# EAGLE schematic Shield Schematic (EAGLE 9.6.2)
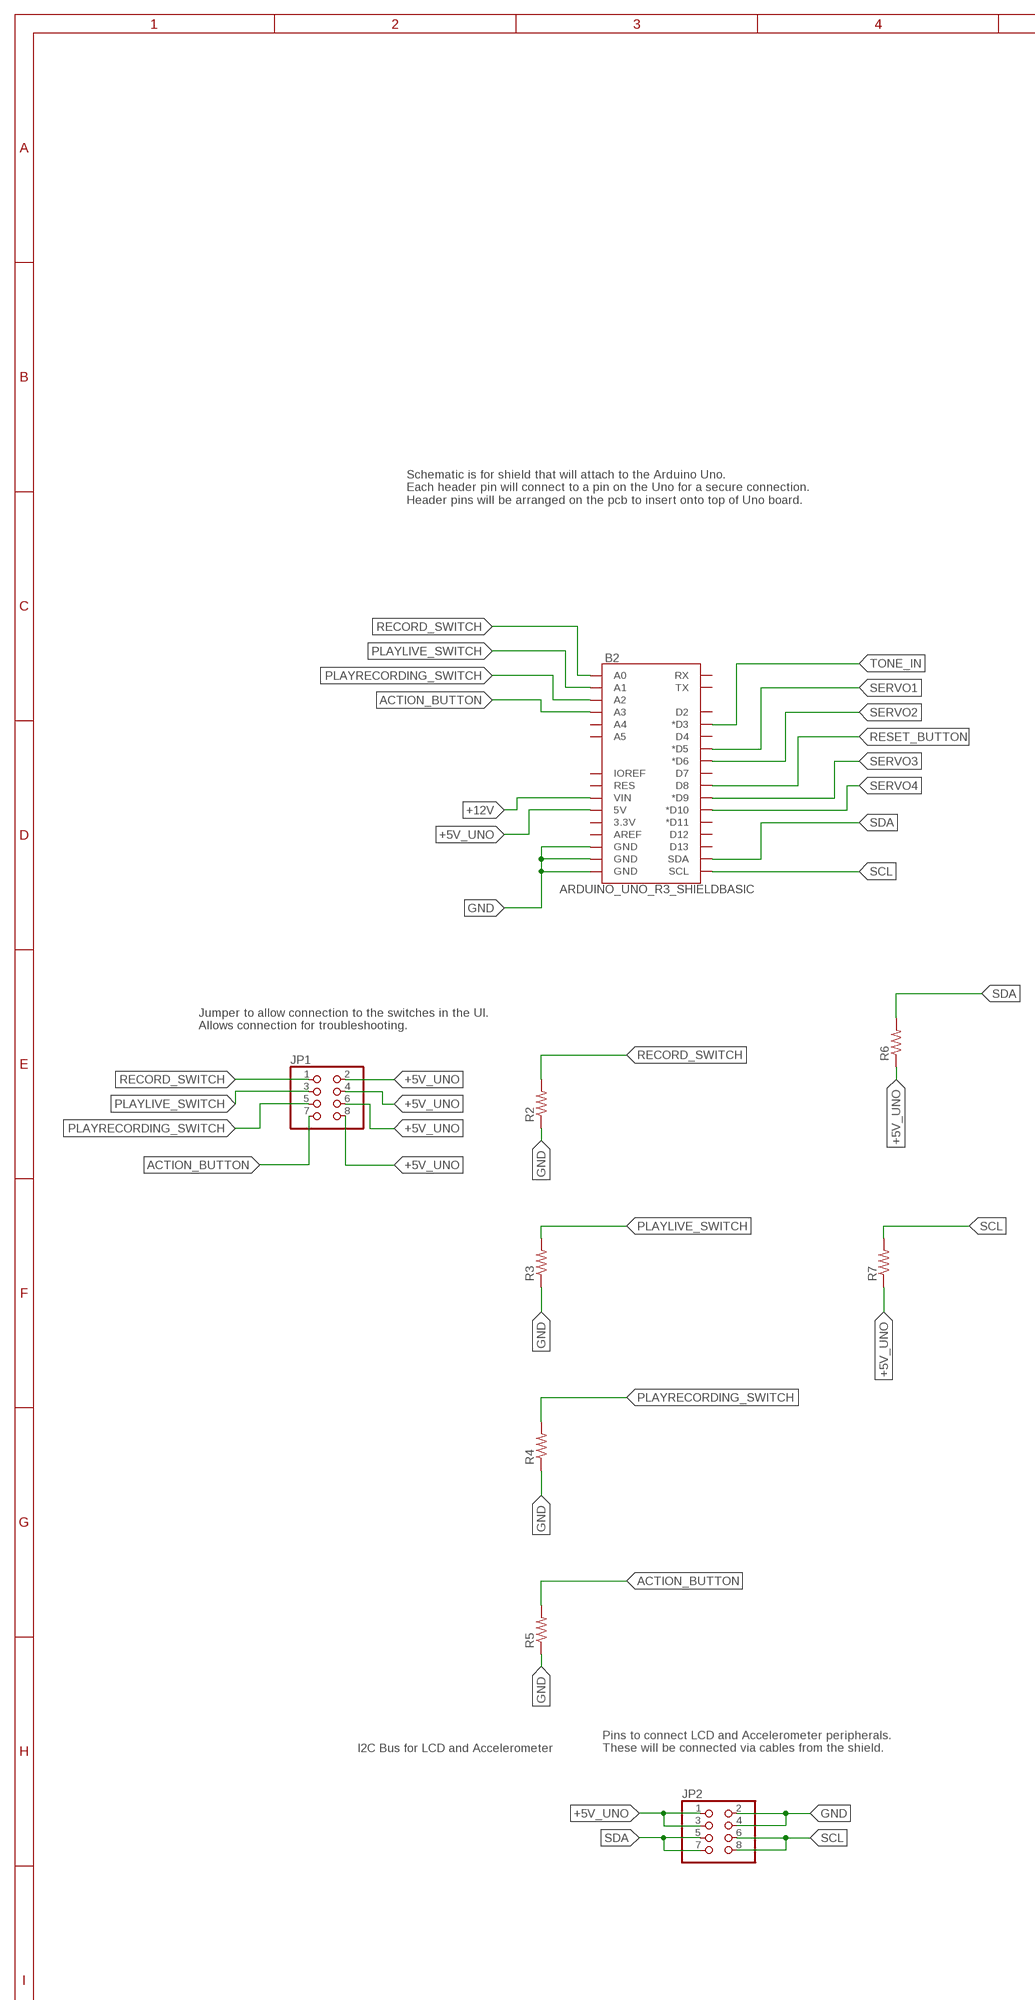
[diagram p0: schematic, sheet 1, part 1 of 2]
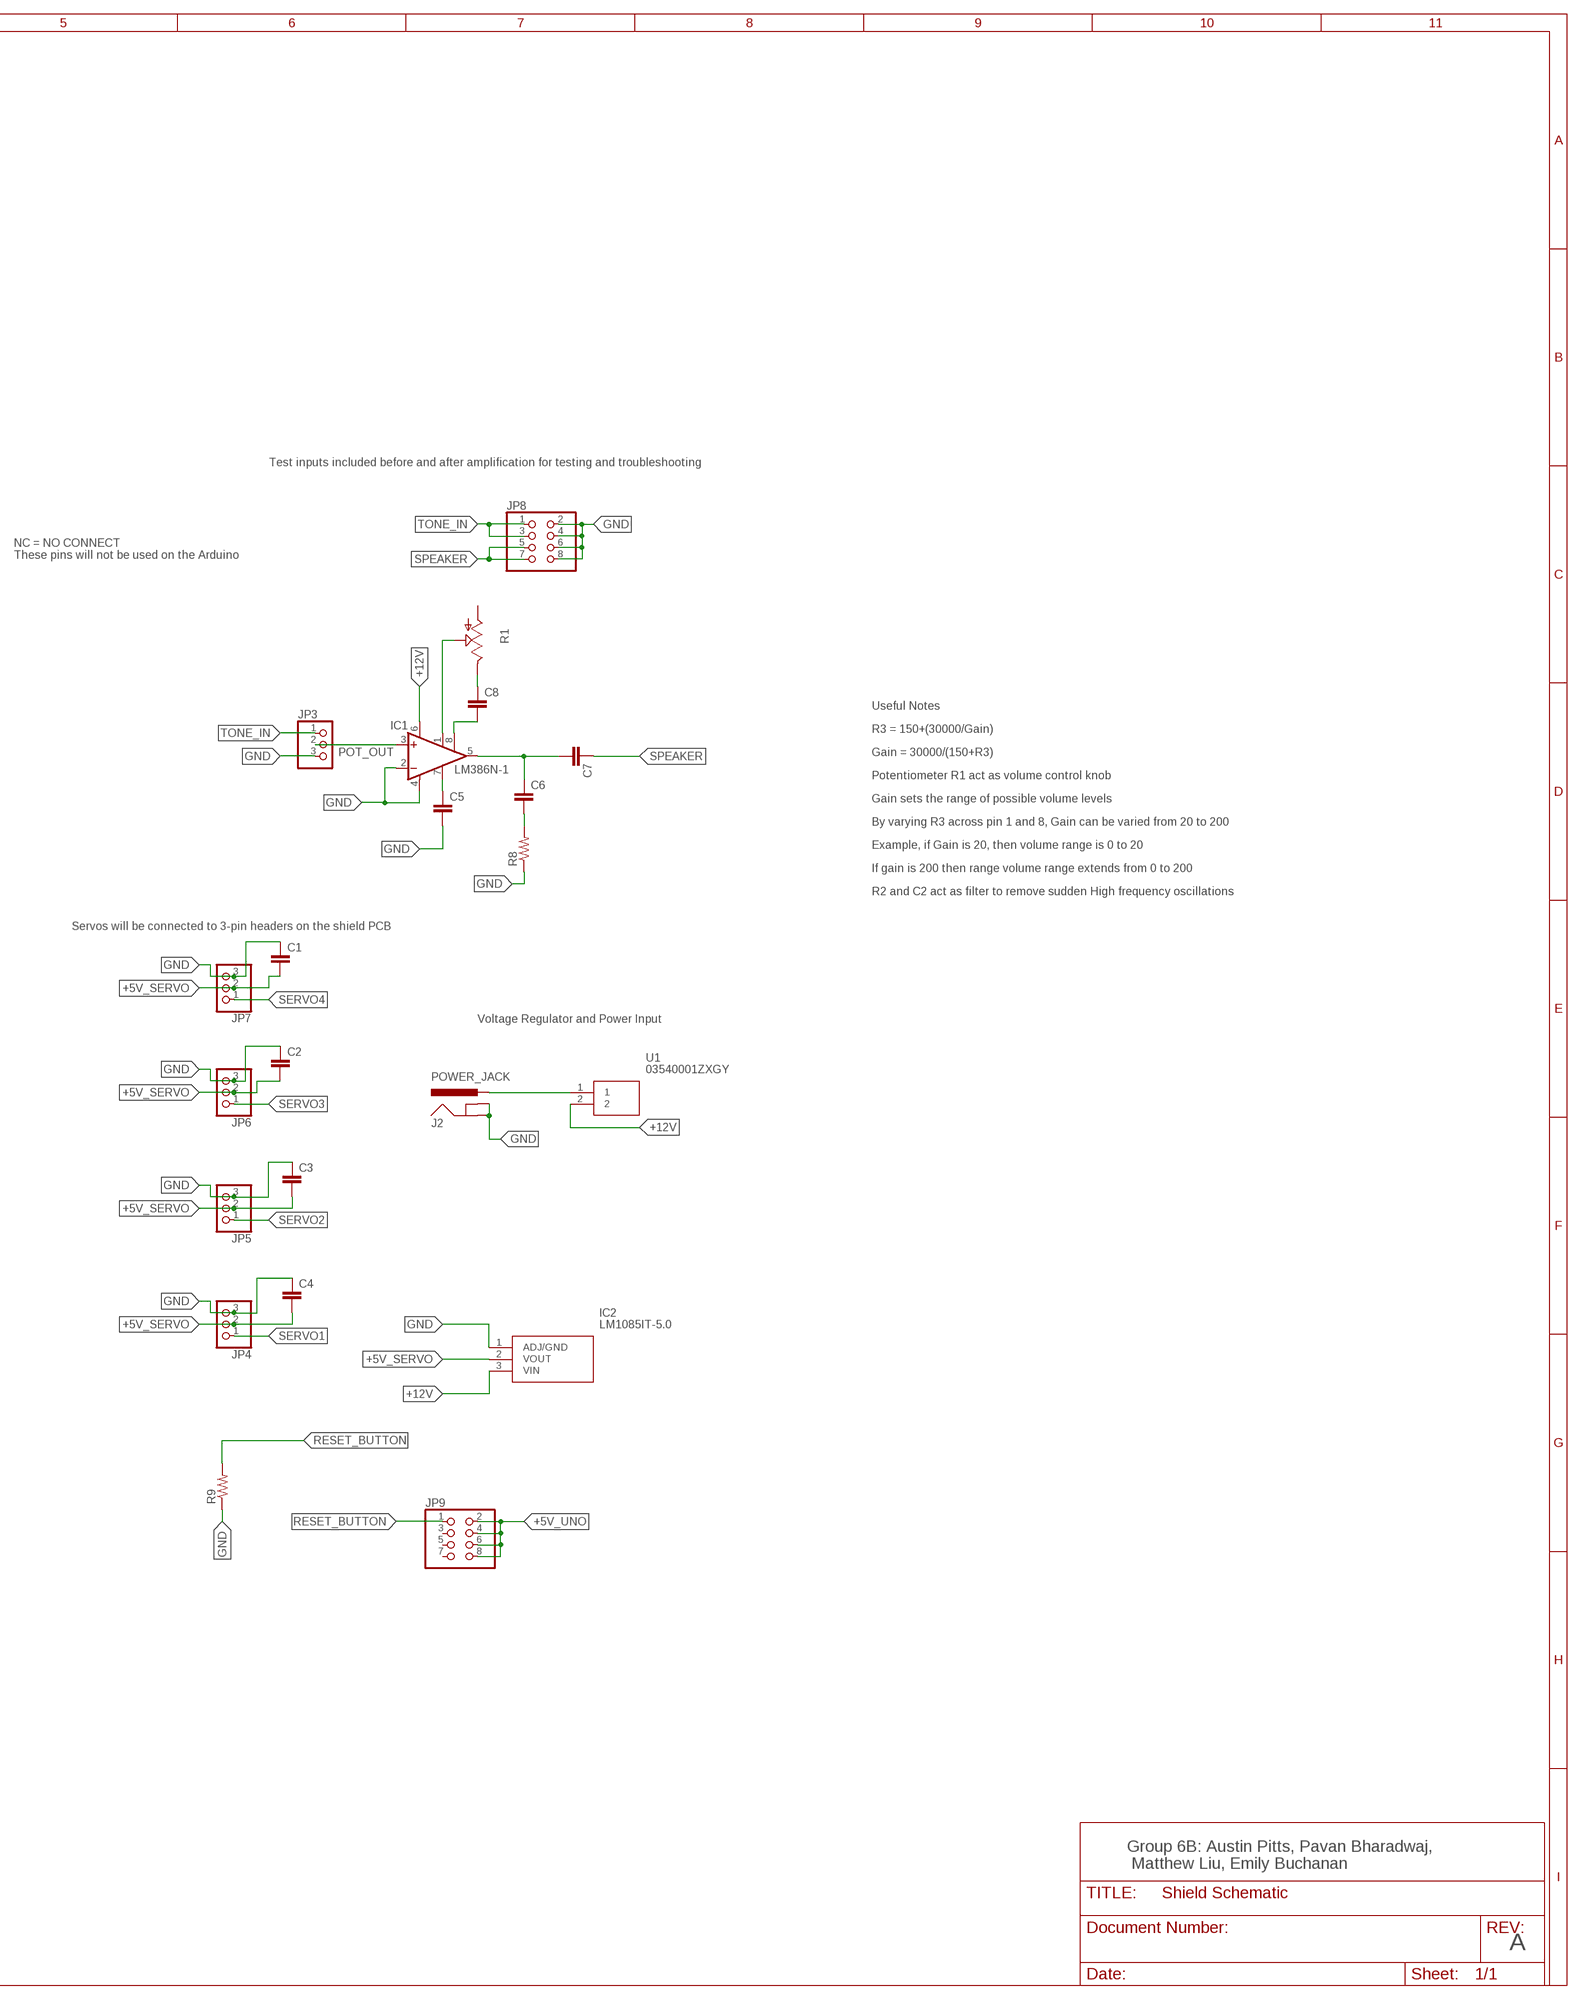
[diagram p1: schematic, sheet 1, part 2 of 2]

## Parts
B2  ARDUINO_UNO_R3_SHIELDBASIC  [UNO_R3_SHIELD]
C1  C2,5-3  [C2.5-3]
C2  C2,5-3  [C2.5-3]
C3  C2,5-3  [C2.5-3]
C4  C2,5-3  [C2.5-3]
C5  C2,5-3  [C2.5-3]
C6  C2,5-3  [C2.5-3]
C7  C2,5-3  [C2.5-3]
C8  C2,5-3  [C2.5-3]
IC1  LM386N-1  [DIL08]
IC2  LM1085IT-5.0  [TO254P470X1016X2222-3P]
J2  POWER_JACK  [POWER_JACK_PTH]
JP1  PINHD-2X4  [2X04]
JP2  PINHD-2X4  [2X04]
JP3  PINHD-1X3  [1X03]
JP4  PINHD-1X3  [1X03]
JP5  PINHD-1X3  [1X03]
JP6  PINHD-1X3  [1X03]
JP7  PINHD-1X3  [1X03]
JP8  PINHD-2X4  [2X04]
JP9  PINHD-2X4  [2X04]
R1  TRIM_US-B25P  [B25P]
R2  R-US_0207/7  [0207/7]
R3  R-US_0207/7  [0207/7]
R4  R-US_0207/7  [0207/7]
R5  R-US_0207/7  [0207/7]
R6  R-US_0207/7  [0207/7]
R7  R-US_0207/7  [0207/7]
R8  R-US_0207/7  [0207/7]
R9  R-US_0207/7  [0207/7]
U1  03540001ZXGY  [03540101ZXGY]

## Nets
+5V_SERVO [Power]: C1.2 C2.2 C3.2 C4.2 IC2.2(VOUT) JP4.2 JP5.2 JP6.2 JP7.2
+5V_UNO [Power]: B2.5V JP1.2 JP1.4 JP1.6 JP1.8 JP2.1 JP2.3 JP9.2 JP9.4 JP9.6 JP9.8 R6.1 R7.1
+12V [Power]: B2.VIN IC1.6(VS) IC2.3(VIN) U1.2
ACTION_BUTTON [Signal]: B2.A3 JP1.7 R5.2
GND [Power]: B2.GND@0(GND) B2.GND@1(GND) B2.GND@2(GND) C1.1 C2.1 C3.1 C4.1 C5.2 IC1.2(-IN) IC1.4(GND) IC2.1(ADJ/GND) J2.GND J2.GNDBREAK JP2.2 JP2.4 JP3.3 JP4.3 JP5.3 JP6.3 JP7.3 JP8.2 JP8.4 JP8.6 JP8.8 R2.1 R3.1 R4.1 R5.1 R8.1 R9.1
N$1 [Power]: J2.PWR U1.1
N$5 [Audio]: C6.1 C7.2 IC1.5(OUT)
N$8 [Audio]: C6.2 R8.2
N$9 [Audio]: C5.1 IC1.7(BYPASS)
N$11 [Audio]: C8.2 IC1.8(GAIN)
N$12 [Audio]: C8.1 R1.E
N$13 [Audio]: IC1.1(GAIN) R1.S
PLAYLIVE_SWITCH [Signal]: B2.A1 JP1.3 R3.2
PLAYRECORDING_SWITCH [Signal]: B2.A2 JP1.5 R4.2
POT_OUT [Audio]: IC1.3(+IN) JP3.2
RECORD_SWITCH [Signal]: B2.A0 JP1.1 R2.2
RESET_BUTTON [Signal]: B2.D8 JP9.1 R9.2
SCL [Signal]: B2.SCL JP2.6 JP2.8 R7.2
SDA [Signal]: B2.SDA JP2.5 JP2.7 R6.2
SERVO1 [Signal]: B2.D5(*D5) JP4.1
SERVO2 [Signal]: B2.D6(*D6) JP5.1
SERVO3 [Signal]: B2.D9(*D9) JP6.1
SERVO4 [Signal]: B2.D10(*D10) JP7.1
SPEAKER [Audio]: C7.1 JP8.5 JP8.7
TONE_IN [Audio]: B2.D3(*D3) JP3.1 JP8.1 JP8.3
Unconnected: B2.3.3V B2.A4 B2.A5 B2.AREF B2.D2 B2.D4 B2.D7 B2.D11(*D11) B2.D12 B2.D13 B2.IOREF B2.RES B2.RX B2.TX JP9.3 JP9.5 JP9.7 R1.A

## Notes on the sheet
- Test inputs included before and after amplification for testing and troubleshooting
- Schematic is for shield that will attach to the Arduino Uno.
  Each header pin will connect to a pin on the Uno for a secure connection.
  Header pins will be arranged on the pcb to insert onto top of Uno board.
- NC = NO CONNECT
  These pins will not be used on the Arduino
- Useful Notes
- R3 = 150+(30000/Gain)
- Gain = 30000/(150+R3)
- Potentiometer R1 act as volume control knob
- Gain sets the range of possible volume levels
- By varying R3 across pin 1 and 8, Gain can be varied from 20 to 200
- Example, if Gain is 20, then volume range is 0 to 20
- If gain is 200 then range volume range extends from 0 to 200
- R2 and C2 act as filter to remove sudden High frequency oscillations
- Servos will be connected to 3-pin headers on the shield PCB
- Jumper to allow connection to the switches in the UI.
  Allows connection for troubleshooting.
- Voltage Regulator and Power Input
- I2C Bus for LCD and Accelerometer
- Pins to connect LCD and Accelerometer peripherals.
  These will be connected via cables from the shield.
- Group 6B: Austin Pitts, Pavan Bharadwaj,
   Matthew Liu, Emily Buchanan
- A

## Library data of the parts
B2 = SparkFun-Boards:ARDUINO_UNO_R3_SHIELD: Arduino R3 Shield Footprint Shield form compatible with the Arduino Uno R3. SparkFun Products: MG2639 Cellular Shield <https://www.sparkfun.com/products/13120> MIDI Shield <https://www.sparkfun.com/products/12898> R3 Stackable Headers Kit <https://www.sparkfun.com/products/11417>
C1-C8 = capacitor-wima:C: CAPACITOR naming: grid - package width
IC1 = linear:LM386?-*: Low Voltage Audio Power Amplifier Source: http://cache.national.com/ds/LM/LM386.pdf
IC2 = SamacSys_Parts:LM1085IT-5.0: IC, LDO VOLT REG, 5V, 1.5A Source: Datasheet; ARROW_PART_NUMBER: LM1085IT-5.0; ARROW_PRICE-STOCK: https://www.arrow.com/en/products/lm1085it-5.0/texas-instruments; DESCRIPTION: IC, LDO VOLT REG, 5V, 1.5A; HEIGHT: mm; MANUFACTURER_NAME: Texas Instruments; MANUFACTURER_PART_NUMBER: LM1085IT-5.0; MOUSER_PART_NUMBER: 926-LM1085IT-50; MOUSER_PRICE-STOCK: https://www.mouser.co.uk/ProductDetail/Texas-Instruments/LM1085IT-50?qs=X1J7HmVL2ZGujKIFphWZug%3D%3D
J2 = SparkFun-Connectors:POWER_JACK: Power Jack Connector This is the standard 5.5mm barrel jack for power. The PTH is the most common, proven, reliable, footprint. The Slot footprint only works if the mill layer is transmitted to the PCB fab house so be warned. Here are the connectors we sell at SparkFun: DC Barrel Power Jack/Connector <https://www.sparkfun.com/products/119> (PRT-00119) DC Barrel Power Jack/Connector (SMD) <https://www.sparkfun.com/products/12748> (PRT-12748) DC Barrel Jack Adapter - Breadboard Compatible <https://www.sparkfun.com/products/10811> (PRT-10811) It is used on this SparkFun product (and many, many others): SparkFun RedBoard - Programmed with Arduino <https://www.sparkfun.com/products/12757> (DEV-12757) Also, if you need a mating power supply or connector, please check these out: Wall Adapter Power Supply - 9VDC 650mA <https://www.sparkfun.com/products/298> (TOL-00298) DC Barrel Jack Adapter - Male <https://www.sparkfun.com/products/10287> (PRT-10287); PROD_ID: CONN-08197
JP1 JP2 JP8 JP9 = adafruit:PINHD-2X4: PIN HEADER
JP3-JP7 = adafruit:PINHD-1X3: PIN HEADER
R1 = pot:TRIM_US-: POTENTIOMETER
R2-R9 = resistor:R-US_: RESISTOR, American symbol
U1 = SamacSys_Parts:03540001ZXGY: Littelfuse 30A Panel Mount 6.3 x 32mm Cartridge Fuse Block, 300V ac/dc Source: Datasheet <https://m.littelfuse.com/~/media/electronics/datasheets/fuse_blocks/littelfuse_fuse_block_354_datasheet.pdf.pdf>; ARROW_PART_NUMBER: 03540001ZXGY; ARROW_PRICE-STOCK: https://www.arrow.com/en/products/03540001zxgy/littelfuse; DESCRIPTION: Littelfuse 30A Panel Mount 6.3 x 32mm Cartridge Fuse Block, 300V ac/dc; HEIGHT: 13mm; MANUFACTURER_NAME: LITTELFUSE; MANUFACTURER_PART_NUMBER: 03540001ZXGY; MOUSER_PART_NUMBER: 576-03540001ZXGY; MOUSER_PRICE-STOCK: https://www.mouser.co.uk/ProductDetail/Littelfuse/03540001ZXGY?qs=2VFNtWizgieffhgauIF6XA%3D%3D

## Net classes
1 Signal: width 0.762 mm, clearance 0.152 mm
2 Power: width 1.524 mm, clearance 0.254 mm
3 Audio: width 0.762 mm, clearance 0.254 mm